# EAGLE design bottle_main (EAGLE 6.4)
AUTHOR: Aleksey Shaporev; DRAWING_AUTHOR: Aleksey Shaporev; DRAWING_COMPANY: Clemson University; REVISION: 0.0
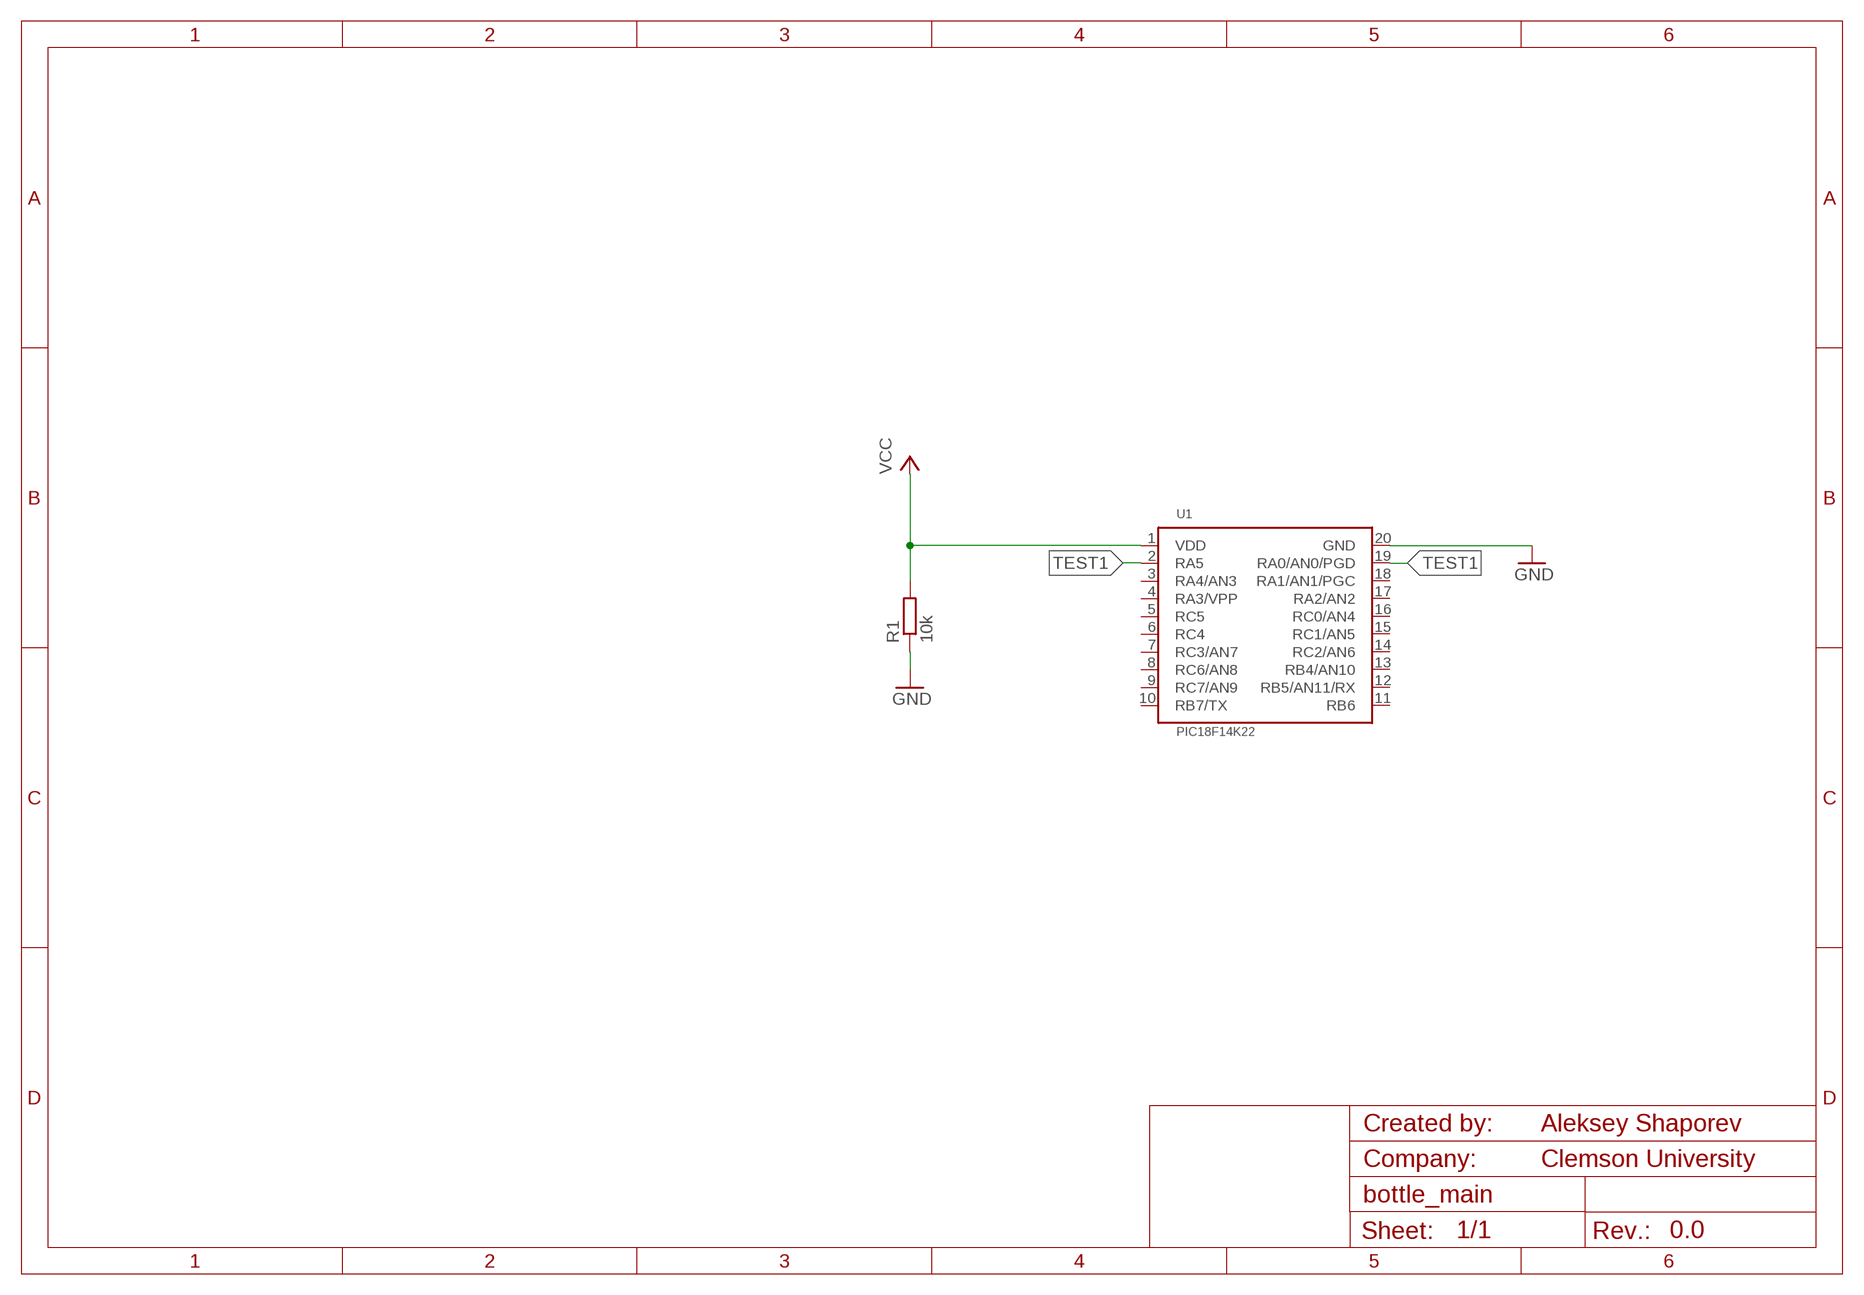
[diagram p0: schematic, sheet 1]

## Parts
R1  10k  R-EU_R0805  [R0805]
U1  PIC18F14K22  PIC18F1XKXX  [SSOP20]

## Nets
GND: R1.1 U1.20(GND)
TEST1: U1.2(RA5) U1.19(RA0/AN0/PGD)
VDD: R1.2 U1.1(VDD) ; supply symbol labelled VCC
Unconnected: U1.3(RA4/AN3) U1.4(RA3/VPP) U1.5(RC5) U1.6(RC4) U1.7(RC3/AN7) U1.8(RC6/AN8) U1.9(RC7/AN9) U1.10(RB7/TX) U1.11(RB6) U1.12(RB5/AN11/RX) U1.13(RB4/AN10) U1.14(RC2/AN6) U1.15(RC1/AN5) U1.16(RC0/AN4) U1.17(RA2/AN2) U1.18(RA1/AN1/PGC)

## Library data of the parts
R1 = resistor:R-EU_: RESISTOR, European symbol
U1 = shaporev:PIC18F1XKXX: PIC18(L)F1XKXX microcontroller covers: PIC18F13K22 PIC18LF13K22 PIC18F13K50 PIC18LF13K22 PIC18F14K22 PIC18LF14K22 PIC18F14K50 PIC18LF14K22

## Board
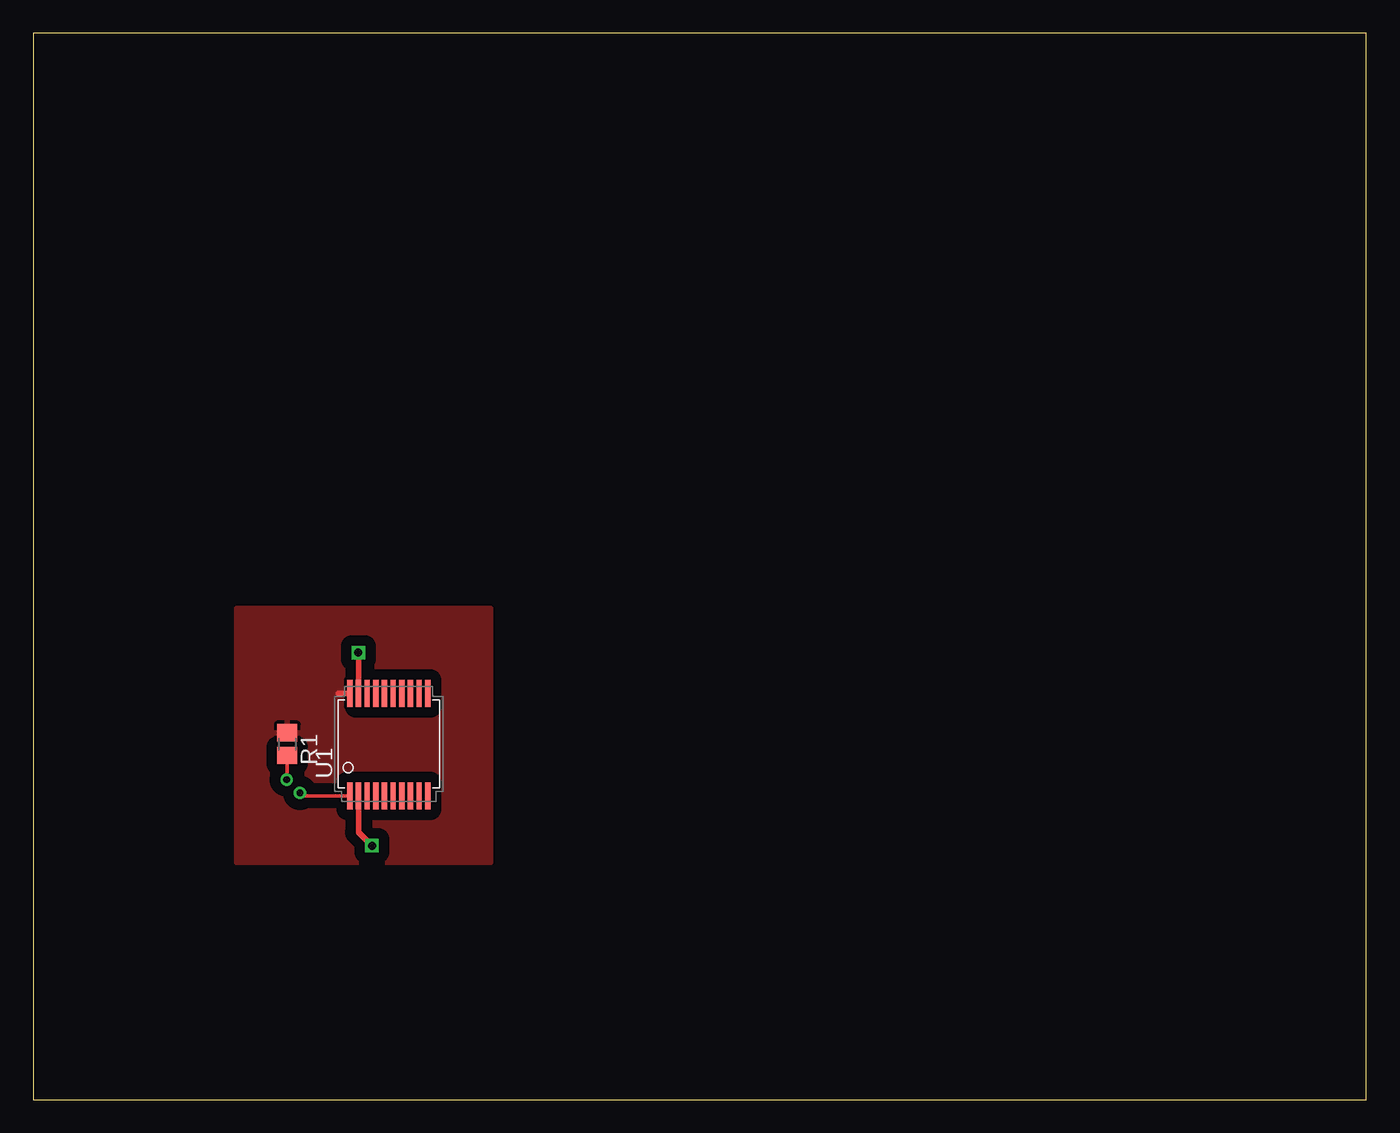
[diagram p1: board, top side]
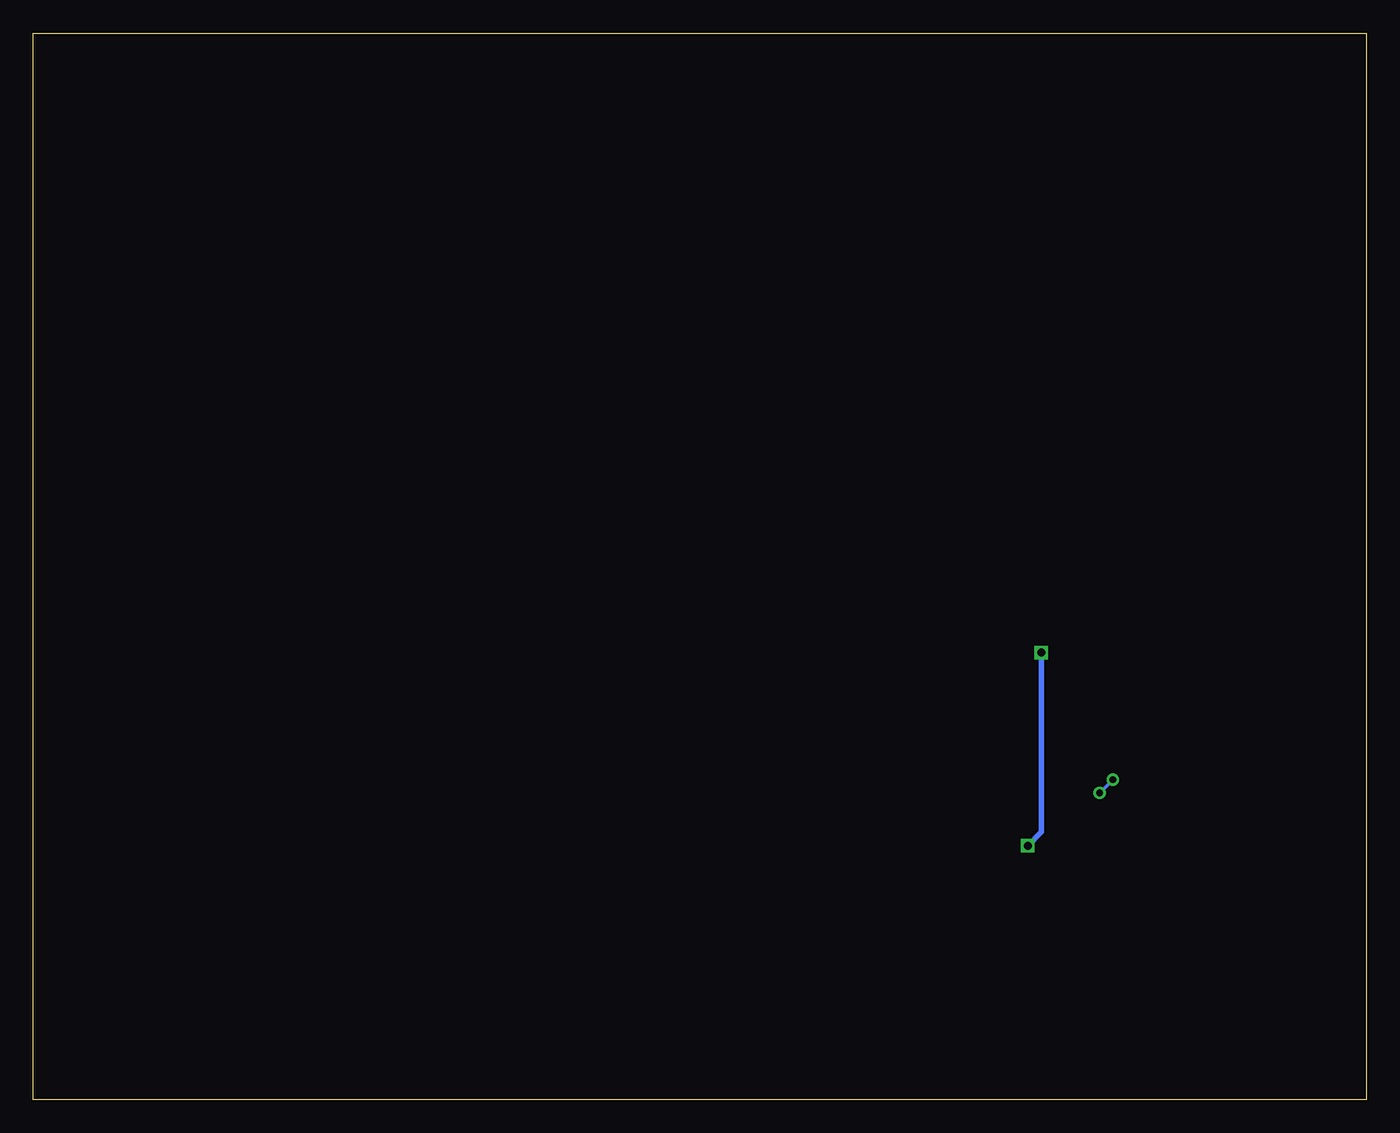
[diagram p2: board, bottom side, seen from below]

Size 100 x 80 mm. Coordinates in mm from the lower left corner, seen from the top.
Outline: 0,0 100,0 100,80 0,80 0,0
Copper layers (1*16): Top 0.035mm / dielectric 1.5mm / Bottom 0.035mm
Design rules "default": minimum track width 10mil, minimum drill 24mil, track to track 8mil, track to pad 8mil, pad to pad 8mil, via to via 8mil, smd to smd 8mil, copper to edge 40mil, drill to drill 8mil, minimum pad ring 10mil, minimum via ring 8mil, stop-mask expansion 4mil, vias tented up to drill 0mil, thermal gap 10mil

### Footprints (pad centres in the part's own frame; a part is rotated, then mirrored left to right if it is on the bottom)
R0805 = smd 1.3 x 1.5: 1 -0.85,0; 2 0.85,0
SSOP20 = smd 0.4 x 2.032: 1 -2.925,-3.886; 2 -2.275,-3.886; 3 -1.625,-3.886; 4 -0.975,-3.886; 5 -0.325,-3.886; 6 0.325,-3.886; 7 0.975,-3.886; 8 1.625,-3.886; 9 2.275,-3.886; 10 2.925,-3.886; 11 2.925,3.81; 12 2.275,3.81; 13 1.625,3.81; 14 0.975,3.81; 15 0.325,3.81; 16 -0.325,3.81; 17 -0.975,3.81; 18 -1.625,3.81; 19 -2.275,3.81; 20 -2.925,3.81

### Placement (x,y rotation side)
R1  19.05,26.67 270 top
U1  26.67,26.67 0 top

### Tracks (layer width: path | path; a pad name or v marks a point on that pad's centre or on a via)
GND
  Top 0.406: U1.20 22.86,30.48
  pour Top (isolate 0.813): 15.24,36.83 34.29,36.83 34.29,17.78 15.24,17.78
TEST1  (via drill 0.6)
  Top 0.406: U1.2 24.39,20.05 v25.4,19.05 | v24.38,33.53 24.39,33.52 U1.19
  Bottom 0.406: v25.4,19.05 24.38,20.07 v24.38,33.53
VDD  (via drill 0.51, 0.51 pad 0.81)
  Top 0.254: U1.1 20.22,22.78 v20,23 | v19,24 19.05,24.05 R1.2
  Bottom 0.254: v20,23 v19,24